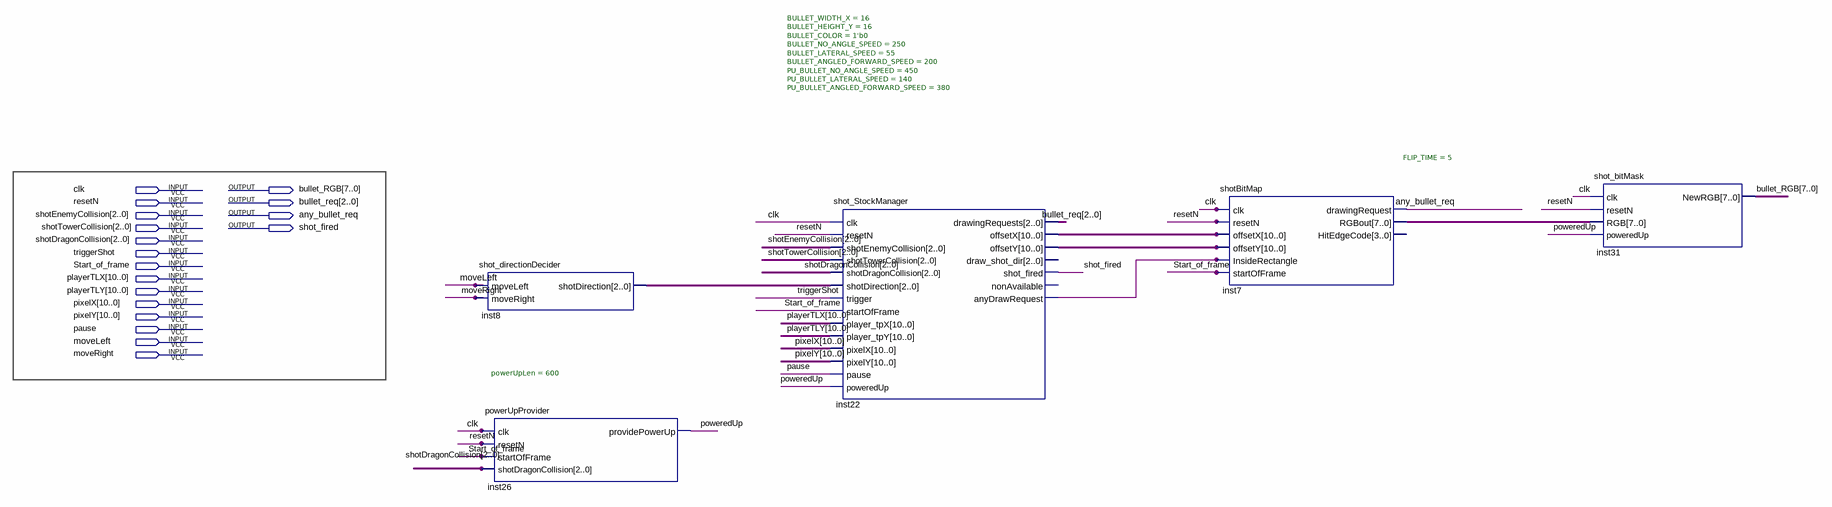
[diagram p0: schematic sheet]
// Quartus schematic TOP_BULLET.bdf as structural Verilog: 5 symbols, 18 pins
module TOP_BULLET (
  input  clk,
  input  resetN,
  input  [2:0] shotEnemyCollision,
  input  [2:0] shotTowerCollision,
  input  [2:0] shotDragonCollision,
  input  triggerShot,
  input  Start_of_frame,
  input  [10:0] playerTLX,
  input  [10:0] playerTLY,
  input  [10:0] pixelX,
  input  [10:0] pixelY,
  input  pause,
  input  moveLeft,
  input  moveRight,
  output [7:0] bullet_RGB,
  output [2:0] bullet_req,
  output any_bullet_req,
  output shot_fired
);

  wire inst22_anydrawrequest, poweredUp;
  wire [2:0] inst8_shotdirection;
  wire [7:0] inst7_rgbout;
  wire [10:0] inst22_offsetx, inst22_offsety;

  shot_directionDecider inst8 (.moveLeft(moveLeft), .moveRight(moveRight), .shotDirection(inst8_shotdirection));
  powerUpProvider #(.powerUpLen(600)) inst26 (
    .clk(clk), .resetN(resetN), .startOfFrame(Start_of_frame), .shotDragonCollision(shotDragonCollision),
    .providePowerUp(poweredUp));
  shot_StockManager #(.BULLET_WIDTH_X(16), .BULLET_HEIGHT_Y(16), .BULLET_COLOR(1'b0), .BULLET_NO_ANGLE_SPEED(250), .BULLET_LATERAL_SPEED(55), .BULLET_ANGLED_FORWARD_SPEED(200), .PU_BULLET_NO_ANGLE_SPEED(450), .PU_BULLET_LATERAL_SPEED(140), .PU_BULLET_ANGLED_FORWARD_SPEED(380)) inst22 (
    .clk(clk), .resetN(resetN), .shotEnemyCollision(shotEnemyCollision),
    .shotTowerCollision(shotTowerCollision), .shotDragonCollision(shotDragonCollision),
    .shotDirection(inst8_shotdirection), .trigger(triggerShot), .startOfFrame(Start_of_frame),
    .player_tpX(playerTLX), .player_tpY(playerTLY), .pixelX(pixelX), .pixelY(pixelY), .pause(pause),
    .poweredUp(poweredUp), .drawingRequests(bullet_req), .offsetX(inst22_offsetx), .offsetY(inst22_offsety),
    .shot_fired(shot_fired), .anyDrawRequest(inst22_anydrawrequest));  // open: draw_shot_dir, nonAvailable
  shotBitMap #(.FLIP_TIME(5)) inst7 (
    .clk(clk), .resetN(resetN), .offsetX(inst22_offsetx), .offsetY(inst22_offsety),
    .InsideRectangle(inst22_anydrawrequest), .startOfFrame(Start_of_frame), .drawingRequest(any_bullet_req),
    .RGBout(inst7_rgbout));  // open: HitEdgeCode
  shot_bitMask inst31 (.clk(clk), .resetN(resetN), .RGB(inst7_rgbout), .poweredUp(poweredUp), .NewRGB(bullet_RGB));
endmodule
